# Altium schematic sheet STM32F072_Platform.SchDoc
size A4
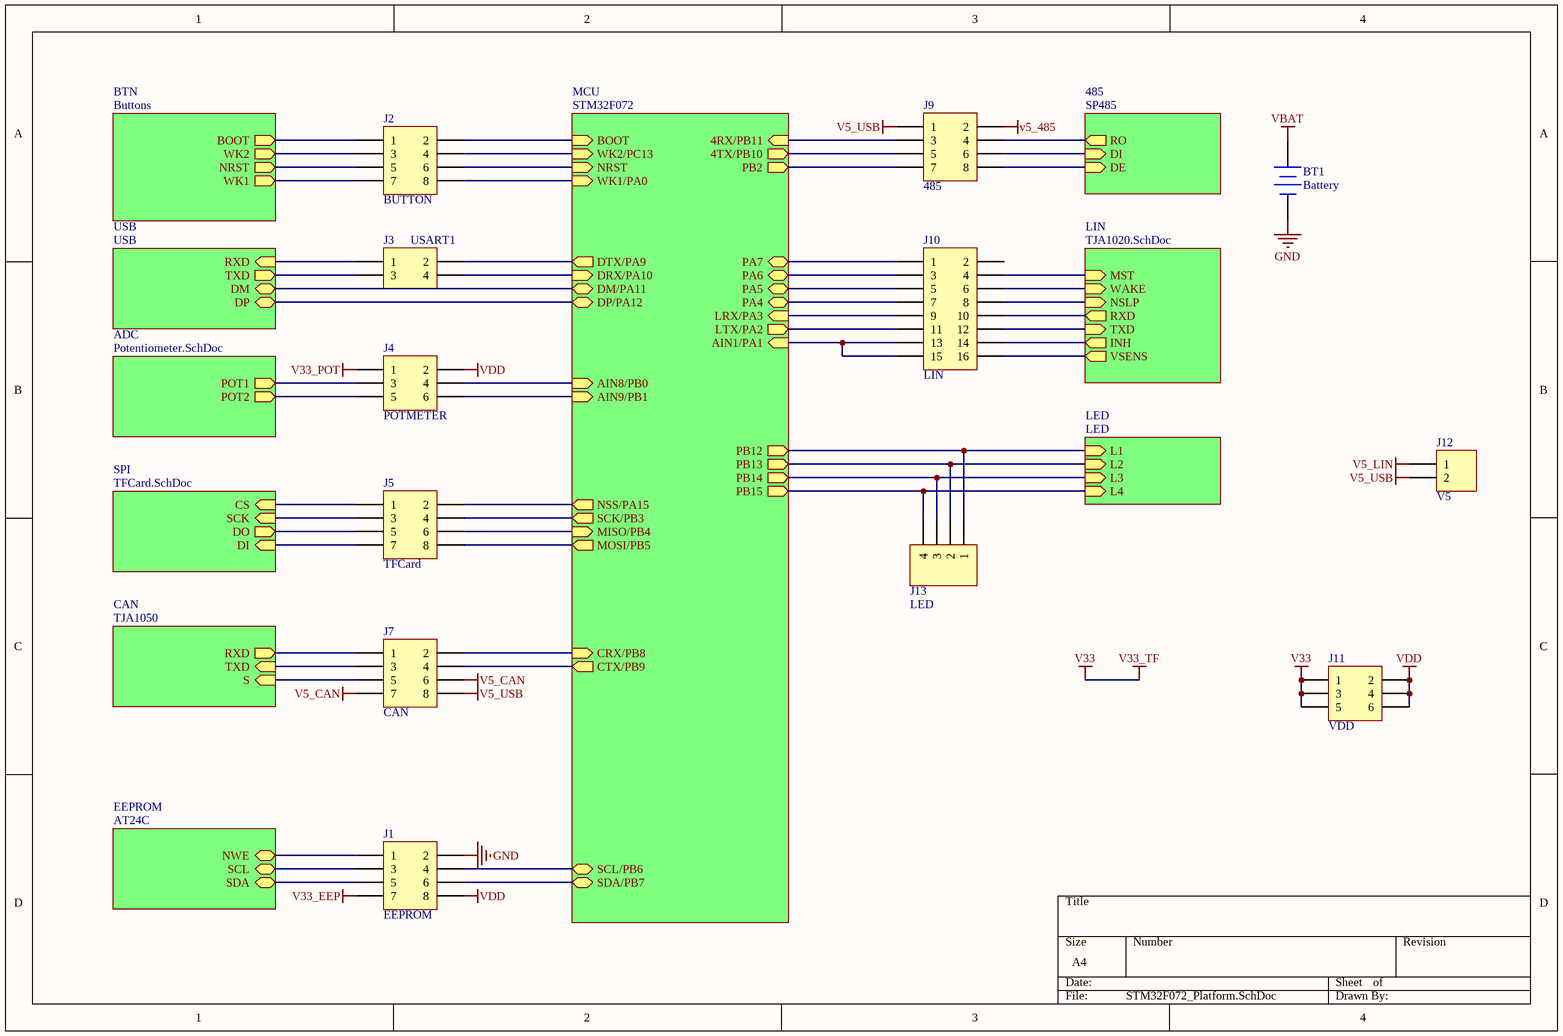
[diagram p0: STM32F072_Platform.SchDoc]

## Parts
BT1  Battery  [CR1220]
J1  EEPROM  [HDR2X4]
J2  BUTTON  [HDR2X4]
J3  USART1  [HDR2X2]
J4  POTMETER  [HDR2X3]
J5  TFCard  [HDR2X4]
J7  CAN  [HDR2X4]
J9  485  [HDR2X4]
J10  LIN  [HDR2X8]
J11  VDD  [HDR2X3]
J12  V5  [HDR1X2]
J13  LED  [HDR2X2]

## Sub-sheets
485 = SP485: RO (out), DI (in), DE (in)
ADC = Potentiometer.SchDoc: POT1 (out), POT2 (out)
BTN = Buttons: NRST (out), BOOT (out), WK1 (out), WK2 (out)
CAN = TJA1050: S (in), TXD (in), RXD (out)
EEPROM = AT24C: SCL, SDA, NWE
LED = LED: L1 (in), L2 (in), L3 (in), L4 (in)
LIN = TJA1020.SchDoc: TXD (in), RXD (out), NSLP (in), WAKE (in), INH (out), MST (in), VSENS (out)
MCU = STM32F072: SCL/PB6, SDA/PB7, NRST (in), BOOT (in), WK1/PA0 (in), WK2/PC13 (in), DM/PA11, DP/PA12, DRX/PA10 (in), DTX/PA9 (out), AIN8/PB0 (in), AIN9/PB1 (in), NSS/PA15 (out), SCK/PB3 (out), MOSI/PB5 (out), MISO/PB4 (in), CTX/PB9 (out), CRX/PB8 (in), 4TX/PB10 (out), 4RX/PB11 (in), LTX/PA2 (out), LRX/PA3 (in), PA4, AIN1/PA1 (in), PA5, PA6, PA7, PB2 (out), PB12 (out), PB13 (out), PB14 (out), PB15 (out)
SPI = TFCard.SchDoc: CS (in), SCK (in), DI (in), DO (out)
USB = USB: DM, DP, TXD (out), RXD (in)

## Nets
GND: BT1.2(-) J1.2
v5_485: J9.2
V5_CAN: J7.6 J7.7
V5_LIN: J12.1
V5_USB: J7.8 J9.1 J12.2
V33: J11.1 J11.3 J11.5  [also labelled V33_TF]
V33_EEP: J1.7
V33_POT: J4.1
VBAT: BT1.1(+)
VDD: J1.8 J4.2 J11.2 J11.4 J11.6
NetJ1_1: J1.1 ; sheet EEPROM/NWE
NetJ1_3: J1.3 ; sheet EEPROM/SCL
NetJ1_4: J1.4 ; sheet MCU/SCL/PB6
NetJ1_5: J1.5 ; sheet EEPROM/SDA
NetJ1_6: J1.6 ; sheet MCU/SDA/PB7
NetJ2_1: J2.1 ; sheet BTN/BOOT
NetJ2_2: J2.2 ; sheet MCU/BOOT
NetJ2_3: J2.3 ; sheet BTN/WK2
NetJ2_4: J2.4 ; sheet MCU/WK2/PC13
NetJ2_5: J2.5 ; sheet BTN/NRST
NetJ2_6: J2.6 ; sheet MCU/NRST
NetJ2_7: J2.7 ; sheet BTN/WK1
NetJ2_8: J2.8 ; sheet MCU/WK1/PA0
NetJ3_1: J3.1 ; sheet USB/RXD
NetJ3_2: J3.2 ; sheet MCU/DTX/PA9
NetJ3_3: J3.3 ; sheet USB/TXD
NetJ3_4: J3.4 ; sheet MCU/DRX/PA10
NetJ4_3: J4.3 ; sheet ADC/POT1
NetJ4_4: J4.4 ; sheet MCU/AIN8/PB0
NetJ4_5: J4.5 ; sheet ADC/POT2
NetJ4_6: J4.6 ; sheet MCU/AIN9/PB1
NetJ5_1: J5.1 ; sheet SPI/CS
NetJ5_2: J5.2 ; sheet MCU/NSS/PA15
NetJ5_3: J5.3 ; sheet SPI/SCK
NetJ5_4: J5.4 ; sheet MCU/SCK/PB3
NetJ5_5: J5.5 ; sheet SPI/DO
NetJ5_6: J5.6 ; sheet MCU/MISO/PB4
NetJ5_7: J5.7 ; sheet SPI/DI
NetJ5_8: J5.8 ; sheet MCU/MOSI/PB5
NetJ7_1: J7.1 ; sheet CAN/RXD
NetJ7_2: J7.2 ; sheet MCU/CRX/PB8
NetJ7_3: J7.3 ; sheet CAN/TXD
NetJ7_4: J7.4 ; sheet MCU/CTX/PB9
NetJ7_5: J7.5 ; sheet CAN/S
NetJ9_3: J9.3 ; sheet MCU/4RX/PB11
NetJ9_4: J9.4 ; sheet 485/RO
NetJ9_5: J9.5 ; sheet MCU/4TX/PB10
NetJ9_6: J9.6 ; sheet 485/DI
NetJ9_7: J9.7 ; sheet MCU/PB2
NetJ9_8: J9.8 ; sheet 485/DE
NetJ10_1: J10.1 ; sheet MCU/PA7
NetJ10_3: J10.3 ; sheet MCU/PA6
NetJ10_4: J10.4 ; sheet LIN/MST
NetJ10_5: J10.5 ; sheet MCU/PA5
NetJ10_6: J10.6 ; sheet LIN/WAKE
NetJ10_7: J10.7 ; sheet MCU/PA4
NetJ10_8: J10.8 ; sheet LIN/NSLP
NetJ10_9: J10.9 ; sheet MCU/LRX/PA3
NetJ10_10: J10.10 ; sheet LIN/RXD
NetJ10_11: J10.11 ; sheet MCU/LTX/PA2
NetJ10_12: J10.12 ; sheet LIN/TXD
NetJ10_13: J10.13 J10.15 ; sheet MCU/AIN1/PA1
NetJ10_14: J10.14 ; sheet LIN/INH
NetJ10_16: J10.16 ; sheet LIN/VSENS
NetJ13_1: J13.1 ; sheet MCU/PB12, sheet LED/L1
NetJ13_2: J13.2 ; sheet MCU/PB13, sheet LED/L2
NetJ13_3: J13.3 ; sheet MCU/PB14, sheet LED/L3
NetJ13_4: J13.4 ; sheet MCU/PB15, sheet LED/L4
(unnamed): sheet MCU/DM/PA11, sheet USB/DM
(unnamed): sheet MCU/DP/PA12, sheet USB/DP

Not connected (* = marked no-connect by the designer): J10 2

## Library data of the parts
BT1 = Battery: Multicell Battery; Published: 24-Mar-1999; LatestRevisionDate: 17-Jul-2002; LatestRevisionNote: Re-released for DXP Platform.; PackageReference: BAT-2; Publisher: Altium Limited; PackageDescription: Battery; 2 Leads
J1 J2 J5 J7 J9 = Header 4X2: Header, 4-Pin, Dual row; LatestRevisionDate: 17-Jul-2002; LatestRevisionNote: Re-released for DXP Platform.; Publisher: Altium Limited
J3 = Header 2X2: Header, 2-Pin, Dual row; LatestRevisionDate: 17-Jul-2002; LatestRevisionNote: Re-released for DXP Platform.; Publisher: Altium Limited
J4 = Header 3X2: POT; LatestRevisionDate: 17-Jul-2002; LatestRevisionNote: Re-released for DXP Platform.; Publisher: Altium Limited
J10 = Header 8X2: Header, 8-Pin, Dual row; LatestRevisionDate: 17-Jul-2002; LatestRevisionNote: Re-released for DXP Platform.; Publisher: Altium Limited
J11 = Header 3X2: Header, 3-Pin, Dual row; LatestRevisionDate: 17-Jul-2002; LatestRevisionNote: Re-released for DXP Platform.; Publisher: Altium Limited
J12 = Header 2: Header, 2-Pin; LatestRevisionDate: 17-Jul-2002; LatestRevisionNote: Re-released for DXP Platform.; Publisher: Altium Limited
J13 = Header 4: Header, 4-Pin; LatestRevisionDate: 17-Jul-2002; LatestRevisionNote: Re-released for DXP Platform.; Publisher: Altium Limited